# Altium schematic sheet JapaneseLayout_OJP_V0_1_Page_2.SchDoc: OJP Japanese Panel
size B; Author: TVW; DrawnBy: TVW; Revision: Alpha 1; SheetNumber: 2; SheetTotal: 1; PageSetup: Record=PageOptions|CenterHorizontal=True|CenterVertical=True|PrintScale=0.95|XCorrection=1.00|YCorrection=1.00|PrintKind=1|BorderSize=5000000|LeftOffset=0|BottomOffset=0|Orientation=2|PaperLength=1000|PaperWidth=1000|Scale=100|PaperSource=7|PrintQuality=-4|MediaType=1|DitherType=10|PaperKind=Letter|PrintScaleMode=1
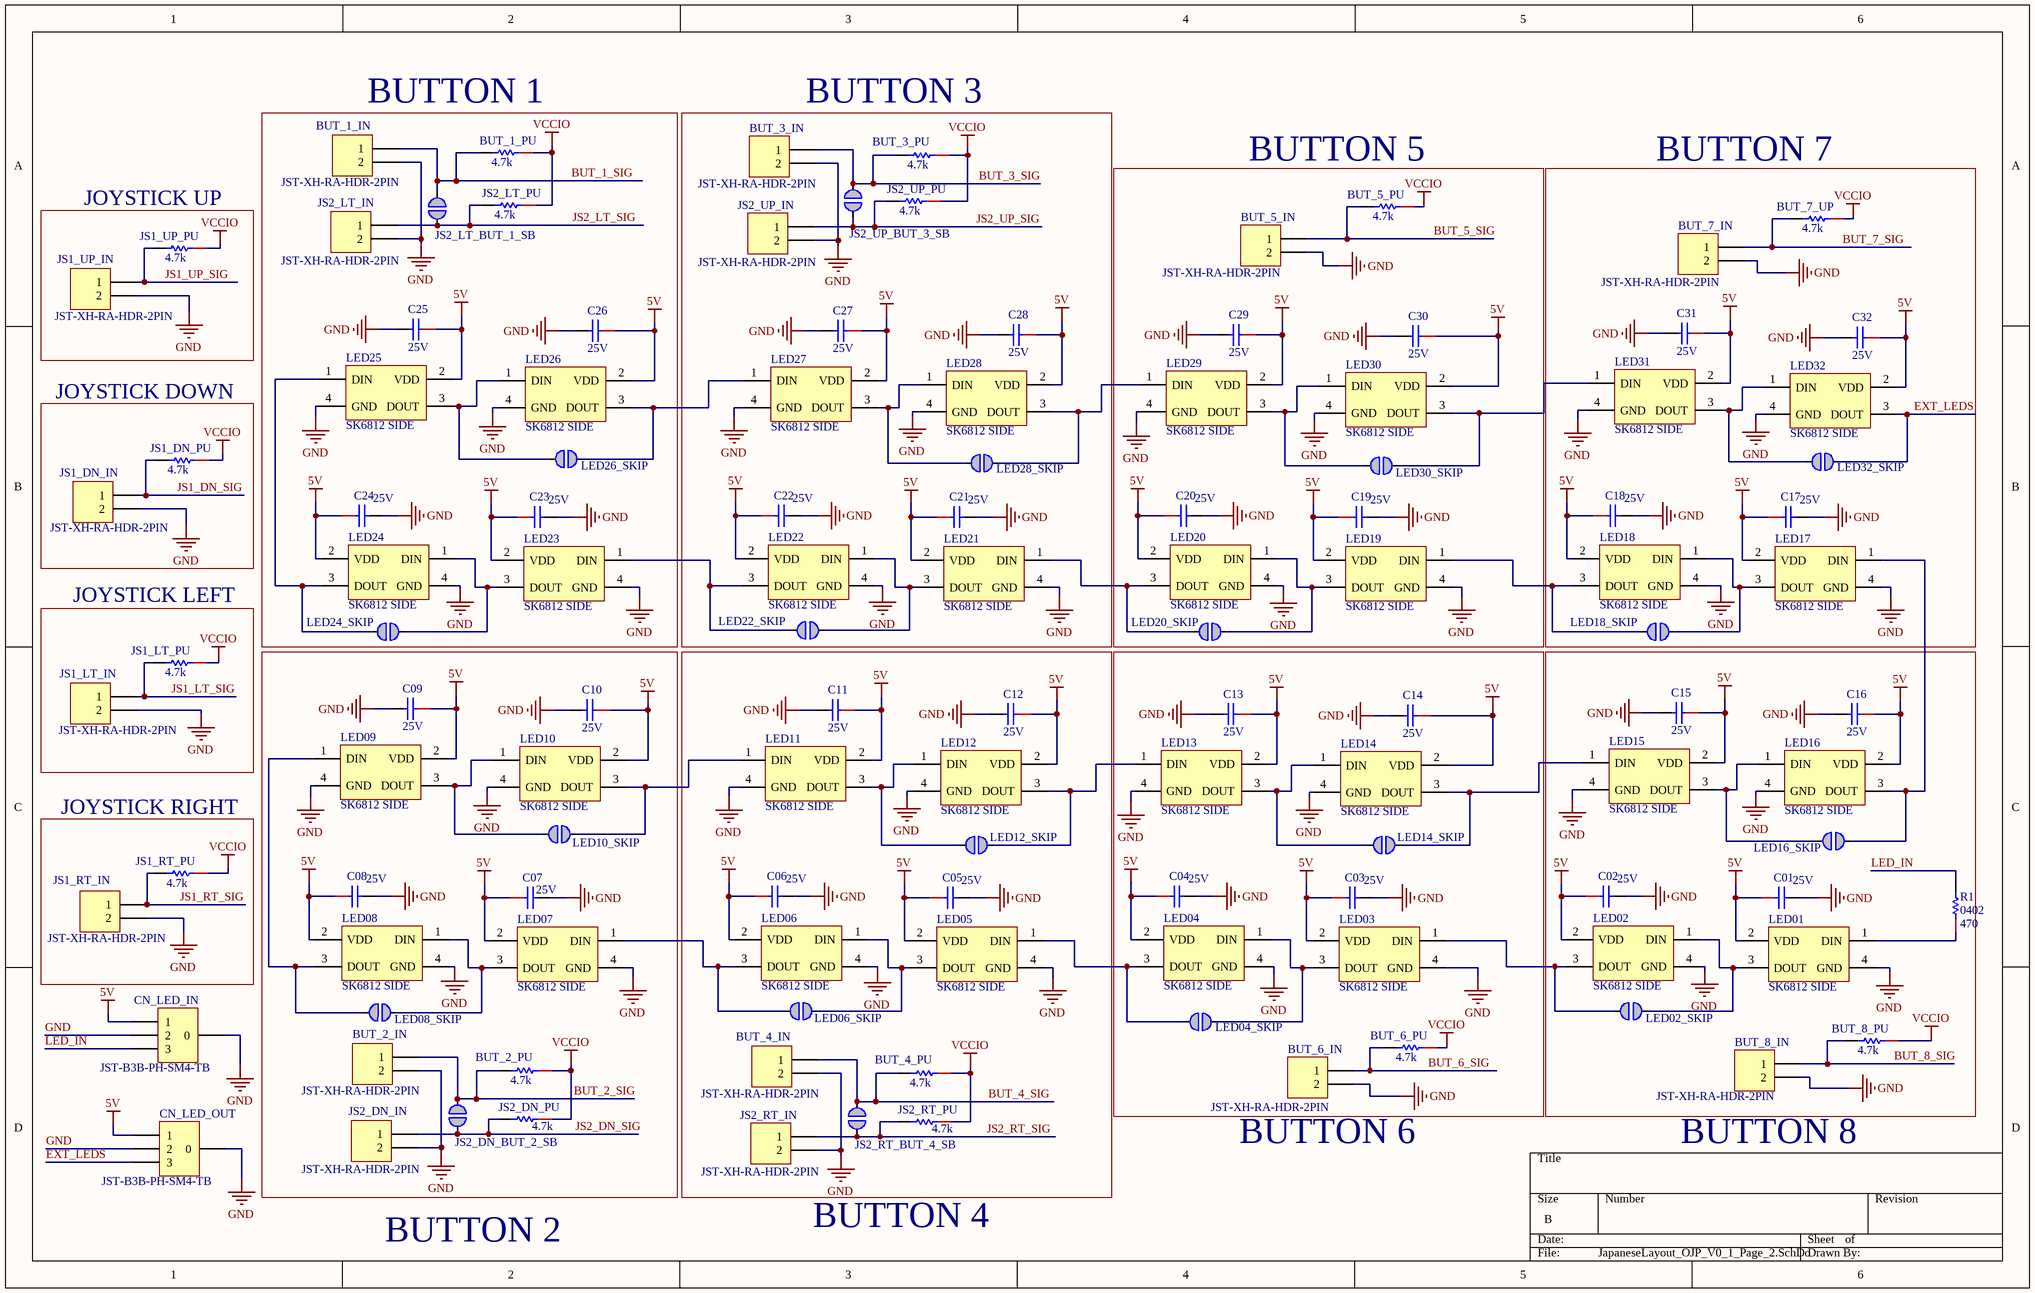
[diagram p0: JapaneseLayout_OJP_V0_1_Page_2.SchDoc]

## Parts
BUT_1_IN  JST-XH-RA-HDR-2PIN  [JST-XH-RA-HDR-2PIN]
BUT_1_PU  4.7K  [RESC0402(1005)_N]  (no BOM)
BUT_2_IN  JST-XH-RA-HDR-2PIN  [JST-XH-RA-HDR-2PIN]
BUT_2_PU  4.7K  [RESC0402(1005)_N]  (no BOM)
BUT_3_IN  JST-XH-RA-HDR-2PIN  [JST-XH-RA-HDR-2PIN]
BUT_3_PU  4.7K  [RESC0402(1005)_N]  (no BOM)
BUT_4_IN  JST-XH-RA-HDR-2PIN  [JST-XH-RA-HDR-2PIN]
BUT_4_PU  4.7K  [RESC0402(1005)_N]  (no BOM)
BUT_5_IN  JST-XH-RA-HDR-2PIN  [JST-XH-RA-HDR-2PIN]
BUT_5_PU  4.7K  [RESC0402(1005)_N]  (no BOM)
BUT_6_IN  JST-XH-RA-HDR-2PIN  [JST-XH-RA-HDR-2PIN]
BUT_6_PU  4.7K  [RESC0402(1005)_N]  (no BOM)
BUT_7_IN  JST-XH-RA-HDR-2PIN  [JST-XH-RA-HDR-2PIN]
BUT_7_UP  4.7K  [RESC0402(1005)_N]  (no BOM)
BUT_8_IN  JST-XH-RA-HDR-2PIN  [JST-XH-RA-HDR-2PIN]
BUT_8_PU  4.7K  [RESC0402(1005)_N]  (no BOM)
C01  Voltage - Rated: 25V  [CAPC0402(1005)_N]  (hidden comment: CAP CER 0.1UF 25V 10% X5R 0402)
C02  Voltage - Rated: 25V  [CAPC0402(1005)_N]  (hidden comment: CAP CER 0.1UF 25V 10% X5R 0402)
C03  Voltage - Rated: 25V  [CAPC0402(1005)_N]  (hidden comment: CAP CER 0.1UF 25V 10% X5R 0402)
C04  Voltage - Rated: 25V  [CAPC0402(1005)_N]  (hidden comment: CAP CER 0.1UF 25V 10% X5R 0402)
C05  Voltage - Rated: 25V  [CAPC0402(1005)_N]  (hidden comment: CAP CER 0.1UF 25V 10% X5R 0402)
C06  Voltage - Rated: 25V  [CAPC0402(1005)_N]  (hidden comment: CAP CER 0.1UF 25V 10% X5R 0402)
C07  Voltage - Rated: 25V  [CAPC0402(1005)_N]  (hidden comment: CAP CER 0.1UF 25V 10% X5R 0402)
C08  Voltage - Rated: 25V  [CAPC0402(1005)_N]  (hidden comment: CAP CER 0.1UF 25V 10% X5R 0402)
C09  Voltage - Rated: 25V  [CAPC0402(1005)_N]  (hidden comment: CAP CER 0.1UF 25V 10% X5R 0402)
C10  Voltage - Rated: 25V  [CAPC0402(1005)_N]  (hidden comment: CAP CER 0.1UF 25V 10% X5R 0402)
C11  Voltage - Rated: 25V  [CAPC0402(1005)_N]  (hidden comment: CAP CER 0.1UF 25V 10% X5R 0402)
C12  Voltage - Rated: 25V  [CAPC0402(1005)_N]  (hidden comment: CAP CER 0.1UF 25V 10% X5R 0402)
C13  Voltage - Rated: 25V  [CAPC0402(1005)_N]  (hidden comment: CAP CER 0.1UF 25V 10% X5R 0402)
C14  Voltage - Rated: 25V  [CAPC0402(1005)_N]  (hidden comment: CAP CER 0.1UF 25V 10% X5R 0402)
C15  Voltage - Rated: 25V  [CAPC0402(1005)_N]  (hidden comment: CAP CER 0.1UF 25V 10% X5R 0402)
C16  Voltage - Rated: 25V  [CAPC0402(1005)_N]  (hidden comment: CAP CER 0.1UF 25V 10% X5R 0402)
C17  Voltage - Rated: 25V  [CAPC0402(1005)_N]  (hidden comment: CAP CER 0.1UF 25V 10% X5R 0402)
C18  Voltage - Rated: 25V  [CAPC0402(1005)_N]  (hidden comment: CAP CER 0.1UF 25V 10% X5R 0402)
C19  Voltage - Rated: 25V  [CAPC0402(1005)_N]  (hidden comment: CAP CER 0.1UF 25V 10% X5R 0402)
C20  Voltage - Rated: 25V  [CAPC0402(1005)_N]  (hidden comment: CAP CER 0.1UF 25V 10% X5R 0402)
C21  Voltage - Rated: 25V  [CAPC0402(1005)_N]  (hidden comment: CAP CER 0.1UF 25V 10% X5R 0402)
C22  Voltage - Rated: 25V  [CAPC0402(1005)_N]  (hidden comment: CAP CER 0.1UF 25V 10% X5R 0402)
C23  Voltage - Rated: 25V  [CAPC0402(1005)_N]  (hidden comment: CAP CER 0.1UF 25V 10% X5R 0402)
C24  Voltage - Rated: 25V  [CAPC0402(1005)_N]  (hidden comment: CAP CER 0.1UF 25V 10% X5R 0402)
C25  Voltage - Rated: 25V  [CAPC0402(1005)_N]  (hidden comment: CAP CER 0.1UF 25V 10% X5R 0402)
C26  Voltage - Rated: 25V  [CAPC0402(1005)_N]  (hidden comment: CAP CER 0.1UF 25V 10% X5R 0402)
C27  Voltage - Rated: 25V  [CAPC0402(1005)_N]  (hidden comment: CAP CER 0.1UF 25V 10% X5R 0402)
C28  Voltage - Rated: 25V  [CAPC0402(1005)_N]  (hidden comment: CAP CER 0.1UF 25V 10% X5R 0402)
C29  Voltage - Rated: 25V  [CAPC0402(1005)_N]  (hidden comment: CAP CER 0.1UF 25V 10% X5R 0402)
C30  Voltage - Rated: 25V  [CAPC0402(1005)_N]  (hidden comment: CAP CER 0.1UF 25V 10% X5R 0402)
C31  Voltage - Rated: 25V  [CAPC0402(1005)_N]  (hidden comment: CAP CER 0.1UF 25V 10% X5R 0402)
C32  Voltage - Rated: 25V  [CAPC0402(1005)_N]  (hidden comment: CAP CER 0.1UF 25V 10% X5R 0402)
CN_LED_IN  JST-B3B-PH-SM4-TB  [JST-B3B-PH-SM4-TB]
CN_LED_OUT  JST-B3B-PH-SM4-TB  [JST-B3B-PH-SM4-TB]
JS1_DN_IN  JST-XH-RA-HDR-2PIN  [JST-XH-RA-HDR-2PIN]
JS1_DN_PU  4.7K  [RESC0402(1005)_N]  (no BOM)
JS1_LT_IN  JST-XH-RA-HDR-2PIN  [JST-XH-RA-HDR-2PIN]
JS1_LT_PU  4.7K  [RESC0402(1005)_N]  (no BOM)
JS1_RT_IN  JST-XH-RA-HDR-2PIN  [JST-XH-RA-HDR-2PIN]
JS1_RT_PU  4.7K  [RESC0402(1005)_N]  (no BOM)
JS1_UP_IN  JST-XH-RA-HDR-2PIN  [JST-XH-RA-HDR-2PIN]
JS1_UP_PU  4.7K  [RESC0402(1005)_N]  (no BOM)
JS2_DN_BUT_2_SB  SOLDERBRIDGE  [Solderbridge]  (value not drawn)  (no BOM)
JS2_DN_IN  JST-XH-RA-HDR-2PIN  [JST-XH-RA-HDR-2PIN]
JS2_DN_PU  4.7K  [RESC0402(1005)_N]  (no BOM)
JS2_LT_BUT_1_SB  SOLDERBRIDGE  [Solderbridge]  (value not drawn)  (no BOM)
JS2_LT_IN  JST-XH-RA-HDR-2PIN  [JST-XH-RA-HDR-2PIN]
JS2_LT_PU  4.7K  [RESC0402(1005)_N]  (no BOM)
JS2_RT_BUT_4_SB  SOLDERBRIDGE  [Solderbridge]  (value not drawn)  (no BOM)
JS2_RT_IN  JST-XH-RA-HDR-2PIN  [JST-XH-RA-HDR-2PIN]
JS2_RT_PU  4.7K  [RESC0402(1005)_N]  (no BOM)
JS2_UP_BUT_3_SB  SOLDERBRIDGE  [Solderbridge]  (value not drawn)  (no BOM)
JS2_UP_IN  JST-XH-RA-HDR-2PIN  [JST-XH-RA-HDR-2PIN]
JS2_UP_PU  4.7K  [RESC0402(1005)_N]  (no BOM)
LED01  SK6812 SIDE  [SOT-553]
LED02  SK6812 SIDE  [SOT-553]
LED02_SKIP  SOLDERBRIDGE  [Solderbridge]  (value not drawn)  (no BOM)
LED03  SK6812 SIDE  [SOT-553]
LED04  SK6812 SIDE  [SOT-553]
LED04_SKIP  SOLDERBRIDGE  [Solderbridge]  (value not drawn)  (no BOM)
LED05  SK6812 SIDE  [SOT-553]
LED06  SK6812 SIDE  [SOT-553]
LED06_SKIP  SOLDERBRIDGE  [Solderbridge]  (value not drawn)  (no BOM)
LED07  SK6812 SIDE  [SOT-553]
LED08  SK6812 SIDE  [SOT-553]
LED08_SKIP  SOLDERBRIDGE  [Solderbridge]  (value not drawn)  (no BOM)
LED09  SK6812 SIDE  [SOT-553]
LED10  SK6812 SIDE  [SOT-553]
LED10_SKIP  SOLDERBRIDGE  [Solderbridge]  (value not drawn)  (no BOM)
LED11  SK6812 SIDE  [SOT-553]
LED12  SK6812 SIDE  [SOT-553]
LED12_SKIP  SOLDERBRIDGE  [Solderbridge]  (value not drawn)  (no BOM)
LED13  SK6812 SIDE  [SOT-553]
LED14  SK6812 SIDE  [SOT-553]
LED14_SKIP  SOLDERBRIDGE  [Solderbridge]  (value not drawn)  (no BOM)
LED15  SK6812 SIDE  [SOT-553]
LED16  SK6812 SIDE  [SOT-553]
LED16_SKIP  SOLDERBRIDGE  [Solderbridge]  (value not drawn)  (no BOM)
LED17  SK6812 SIDE  [SOT-553]
LED18  SK6812 SIDE  [SOT-553]
LED18_SKIP  SOLDERBRIDGE  [Solderbridge]  (value not drawn)  (no BOM)
LED19  SK6812 SIDE  [SOT-553]
LED20  SK6812 SIDE  [SOT-553]
LED20_SKIP  SOLDERBRIDGE  [Solderbridge]  (value not drawn)  (no BOM)
LED21  SK6812 SIDE  [SOT-553]
LED22  SK6812 SIDE  [SOT-553]
LED22_SKIP  SOLDERBRIDGE  [Solderbridge]  (value not drawn)  (no BOM)
LED23  SK6812 SIDE  [SOT-553]
LED24  SK6812 SIDE  [SOT-553]
LED24_SKIP  SOLDERBRIDGE  [Solderbridge]  (value not drawn)  (no BOM)
LED25  SK6812 SIDE  [SOT-553]
LED26  SK6812 SIDE  [SOT-553]
LED26_SKIP  SOLDERBRIDGE  [Solderbridge]  (value not drawn)  (no BOM)
LED27  SK6812 SIDE  [SOT-553]
LED28  SK6812 SIDE  [SOT-553]
LED28_SKIP  SOLDERBRIDGE  [Solderbridge]  (value not drawn)  (no BOM)
LED29  SK6812 SIDE  [SOT-553]
LED30  SK6812 SIDE  [SOT-553]
LED30_SKIP  SOLDERBRIDGE  [Solderbridge]  (value not drawn)  (no BOM)
LED31  SK6812 SIDE  [SOT-553]
LED32  SK6812 SIDE  [SOT-553]
LED32_SKIP  SOLDERBRIDGE  [Solderbridge]  (value not drawn)  (no BOM)
R1  Package (Imperial): 0402  [RESC0402(1005)_M]  (hidden comment: 470)

## Blocks framed on the sheet
BUTTON 1: BUT_1_IN BUT_1_PU C23-C26 JS2_LT_BUT_1_SB JS2_LT_IN JS2_LT_PU LED23 LED24 LED24_SKIP LED25 LED26 LED26_SKIP
BUTTON 3: BUT_3_IN BUT_3_PU C21 C22 C27 C28 JS2_UP_BUT_3_SB JS2_UP_IN JS2_UP_PU LED21 LED22 LED22_SKIP LED27 LED28 LED28_SKIP
BUTTON 5: BUT_5_IN BUT_5_PU C19 C20 C29 C30 LED19 LED20 LED20_SKIP LED29 LED30 LED30_SKIP
BUTTON 7: BUT_7_IN BUT_7_UP C17 C18 C31 C32 LED17 LED18 LED18_SKIP LED31 LED32 LED32_SKIP
JOYSTICK UP: JS1_UP_IN JS1_UP_PU
JOYSTICK DOWN: JS1_DN_IN JS1_DN_PU
JOYSTICK LEFT: JS1_LT_IN JS1_LT_PU
JOYSTICK RIGHT: JS1_RT_IN JS1_RT_PU

## Nets
5V: C01.1 C02.1 C03.1 C04.1 C05.1 C06.1 C07.1 C08.1 C09.1 C10.1 C11.1 C12.1 C13.1 C14.1 C15.1 C16.1 C17.1 C18.1 C19.1 C20.1 C21.1 C22.1 C23.1 C24.1 C25.1 C26.1 C27.1 C28.1 C29.1 C30.1 C31.1 C32.1 CN_LED_IN.1 CN_LED_OUT.1 LED01.2(VDD) LED02.2(VDD) LED03.2(VDD) LED04.2(VDD) LED05.2(VDD) LED06.2(VDD) LED07.2(VDD) LED08.2(VDD) LED09.2(VDD) LED10.2(VDD) LED11.2(VDD) LED12.2(VDD) LED13.2(VDD) LED14.2(VDD) LED15.2(VDD) LED16.2(VDD) LED17.2(VDD) LED18.2(VDD) LED19.2(VDD) LED20.2(VDD) LED21.2(VDD) LED22.2(VDD) LED23.2(VDD) LED24.2(VDD) LED25.2(VDD) LED26.2(VDD) LED27.2(VDD) LED28.2(VDD) LED29.2(VDD) LED30.2(VDD) LED31.2(VDD) LED32.2(VDD)
GND: BUT_1_IN.2 BUT_2_IN.2 BUT_3_IN.2 BUT_4_IN.2 BUT_5_IN.2 BUT_6_IN.2 BUT_7_IN.2 BUT_8_IN.2 C01.2 C02.2 C03.2 C04.2 C05.2 C06.2 C07.2 C08.2 C09.2 C10.2 C11.2 C12.2 C13.2 C14.2 C15.2 C16.2 C17.2 C18.2 C19.2 C20.2 C21.2 C22.2 C23.2 C24.2 C25.2 C26.2 C27.2 C28.2 C29.2 C30.2 C31.2 C32.2 CN_LED_IN.0 CN_LED_IN.2 CN_LED_OUT.0 CN_LED_OUT.2 JS1_DN_IN.2 JS1_LT_IN.2 JS1_RT_IN.2 JS1_UP_IN.2 JS2_DN_IN.2 JS2_LT_IN.2 JS2_RT_IN.2 JS2_UP_IN.2 LED01.4(GND) LED02.4(GND) LED03.4(GND) LED04.4(GND) LED05.4(GND) LED06.4(GND) LED07.4(GND) LED08.4(GND) LED09.4(GND) LED10.4(GND) LED11.4(GND) LED12.4(GND) LED13.4(GND) LED14.4(GND) LED15.4(GND) LED16.4(GND) LED17.4(GND) LED18.4(GND) LED19.4(GND) LED20.4(GND) LED21.4(GND) LED22.4(GND) LED23.4(GND) LED24.4(GND) LED25.4(GND) LED26.4(GND) LED27.4(GND) LED28.4(GND) LED29.4(GND) LED30.4(GND) LED31.4(GND) LED32.4(GND)
VCCIO: BUT_1_PU.1 BUT_2_PU.1 BUT_3_PU.1 BUT_4_PU.1 BUT_5_PU.1 BUT_6_PU.1 BUT_7_UP.1 BUT_8_PU.1 JS1_DN_PU.1 JS1_LT_PU.1 JS1_RT_PU.1 JS1_UP_PU.1 JS2_DN_PU.1 JS2_LT_PU.1 JS2_RT_PU.1 JS2_UP_PU.1
BUT_1_SIG: BUT_1_IN.1 BUT_1_PU.2 JS2_LT_BUT_1_SB.1
BUT_2_SIG: BUT_2_IN.1 BUT_2_PU.2 JS2_DN_BUT_2_SB.1
BUT_3_SIG: BUT_3_IN.1 BUT_3_PU.2 JS2_UP_BUT_3_SB.1
BUT_4_SIG: BUT_4_IN.1 BUT_4_PU.2 JS2_RT_BUT_4_SB.1
BUT_5_SIG: BUT_5_IN.1 BUT_5_PU.2
BUT_6_SIG: BUT_6_IN.1 BUT_6_PU.2
BUT_7_SIG: BUT_7_IN.1 BUT_7_UP.2
BUT_8_SIG: BUT_8_IN.1 BUT_8_PU.2
EXT_LEDS: CN_LED_OUT.3 LED32.3(DOUT) LED32_SKIP.1
JS1_DN_SIG: JS1_DN_IN.1 JS1_DN_PU.2
JS1_LT_SIG: JS1_LT_IN.1 JS1_LT_PU.2
JS1_RT_SIG: JS1_RT_IN.1 JS1_RT_PU.2
JS1_UP_SIG: JS1_UP_IN.1 JS1_UP_PU.2
JS2_DN_SIG: JS2_DN_BUT_2_SB.2 JS2_DN_IN.1 JS2_DN_PU.2
JS2_LT_SIG: JS2_LT_BUT_1_SB.2 JS2_LT_IN.1 JS2_LT_PU.2
JS2_RT_SIG: JS2_RT_BUT_4_SB.2 JS2_RT_IN.1 JS2_RT_PU.2
JS2_UP_SIG: JS2_UP_BUT_3_SB.2 JS2_UP_IN.1 JS2_UP_PU.2
LED_IN: CN_LED_IN.3 R1.2
NetLED01_1: LED01.1(DIN) R1.1
NetLED01_3: LED01.3(DOUT) LED02.1(DIN) LED02_SKIP.1
NetLED02_3: LED02.3(DOUT) LED02_SKIP.2 LED03.1(DIN)
NetLED03_3: LED03.3(DOUT) LED04.1(DIN) LED04_SKIP.1
NetLED04_3: LED04.3(DOUT) LED04_SKIP.2 LED05.1(DIN)
NetLED05_3: LED05.3(DOUT) LED06.1(DIN) LED06_SKIP.1
NetLED06_3: LED06.3(DOUT) LED06_SKIP.2 LED07.1(DIN)
NetLED07_3: LED07.3(DOUT) LED08.1(DIN) LED08_SKIP.1
NetLED08_3: LED08.3(DOUT) LED08_SKIP.2 LED09.1(DIN)
NetLED09_3: LED09.3(DOUT) LED10.1(DIN) LED10_SKIP.2
NetLED10_3: LED10.3(DOUT) LED10_SKIP.1 LED11.1(DIN)
NetLED11_3: LED11.3(DOUT) LED12.1(DIN) LED12_SKIP.2
NetLED12_3: LED12.3(DOUT) LED12_SKIP.1 LED13.1(DIN)
NetLED13_3: LED13.3(DOUT) LED14.1(DIN) LED14_SKIP.2
NetLED14_3: LED14.3(DOUT) LED14_SKIP.1 LED15.1(DIN)
NetLED15_3: LED15.3(DOUT) LED16.1(DIN) LED16_SKIP.2
NetLED16_3: LED16.3(DOUT) LED16_SKIP.1 LED17.1(DIN)
NetLED17_3: LED17.3(DOUT) LED18.1(DIN) LED18_SKIP.1
NetLED18_3: LED18.3(DOUT) LED18_SKIP.2 LED19.1(DIN)
NetLED19_3: LED19.3(DOUT) LED20.1(DIN) LED20_SKIP.1
NetLED20_3: LED20.3(DOUT) LED20_SKIP.2 LED21.1(DIN)
NetLED21_3: LED21.3(DOUT) LED22.1(DIN) LED22_SKIP.1
NetLED22_3: LED22.3(DOUT) LED22_SKIP.2 LED23.1(DIN)
NetLED23_3: LED23.3(DOUT) LED24.1(DIN) LED24_SKIP.1
NetLED24_3: LED24.3(DOUT) LED24_SKIP.2 LED25.1(DIN)
NetLED25_3: LED25.3(DOUT) LED26.1(DIN) LED26_SKIP.2
NetLED26_3: LED26.3(DOUT) LED26_SKIP.1 LED27.1(DIN)
NetLED27_3: LED27.3(DOUT) LED28.1(DIN) LED28_SKIP.2
NetLED28_3: LED28.3(DOUT) LED28_SKIP.1 LED29.1(DIN)
NetLED29_3: LED29.3(DOUT) LED30.1(DIN) LED30_SKIP.2
NetLED30_3: LED30.3(DOUT) LED30_SKIP.1 LED31.1(DIN)
NetLED31_3: LED31.3(DOUT) LED32.1(DIN) LED32_SKIP.2

## Notes on the sheet
- (near BUT_6_IN) BUTTON 6
- (near BUT_8_IN) BUTTON 8
- BUTTON 2
- BUTTON 4
- Title
- By:
- Date:
- Number:
- Time:
- Revision:
- Sheet
- of
- OLogic, Inc.
- 3350 Scott Blvd. Bldg 47
- Santa Clara, CA
- 95054 USA
- File:
- (650) 996-1490

## Library data of the parts
BUT_1_IN BUT_2_IN BUT_3_IN BUT_4_IN BUT_5_IN BUT_6_IN BUT_7_IN BUT_8_IN JS1_DN_IN JS1_LT_IN JS1_RT_IN JS1_UP_IN JS2_DN_IN JS2_LT_IN JS2_RT_IN JS2_UP_IN = CMP-001-1623-04: 2.5 mm JST XH-Style Shrouded Male Connector: 2-Pin, Right Angle; Pololu #2718
BUT_1_PU BUT_2_PU BUT_3_PU BUT_4_PU BUT_5_PU BUT_6_PU BUT_7_UP BUT_8_PU JS1_DN_PU JS1_LT_PU JS1_RT_PU JS1_UP_PU JS2_DN_PU JS2_LT_PU JS2_RT_PU JS2_UP_PU = CMP-007-0497-12: RES 4.7K OHM 1% 1/10W 0402; Power: 100mW; Temperature Coefficient: 100ppm/°C; Package_Imperial: 0402; Package_Metric: 1005; Termination: SMD/SMT; Resistance: 4.7k; Tolerance: 1%; Width: 500µm; Length: 1mm; Height: 550µm
C01 C02 C03 C04 C05 C06 C07 C08 C09-C32 = CMP-007-0044-02: 0.1uF 0402 25V; Manufacturer: Taiyo Yuden; Manufacturer Part Number: TMK105BJ104KV-F; Notification: Current market demand for these product types have resulted in fluctuating and extending lead times. Lead times may differ.; Part Status: Active; ComponentLink1Description: http://ds.yuden.co.jp/TYCOMPAS/ut/detail.do?productNo=TMK105BJ104KV-F&fileName=TMK105BJ104KV-F_SS&mode=specSheetDownload; Ratings: -; Pin Count: 2; Designator: CAP CER 0.1UF 25V 10% X5R 0402; Operating Temperature: -55°C ~ 85°C; Height - Seated (Max): -; Packaging: Cut Tape (CT); Lead Style: -; Temperature Coefficient: X5R; Stock 1: 5172635; Lead Spacing: -; Pricing 1: 1=0.1, 10=0.043, 100=0.019, 500=0.0136, 1000=0.01069, 2500=0.00972, 5000=0.00894 (USD); Mounting Type: Surface Mount, MLCC; RoHS: RoHS Compliant; Tolerance: ±10%; Component Name: CAP CER 0.1UF 25V 10% X5R 0402; Features: -; Applications: General Purpose; ComponentLink1URL: http://ds.yuden.co.jp/TYCOMPAS/ut/detail.do?productNo=TMK105BJ104KV-F&fileName=TMK105BJ104KV-F_SS&mode=specSheetDownload
CN_LED_IN CN_LED_OUT = CMP-001-0357-02: 2mm Locking Header, 3-Pin; Manufacturer Part Number: B3B-PH-SM4-TB(LF)(SN)(P); Manufacturer: JST Sales America Inc; Number of Positions Loaded: All; Number of Positions: 3; Connector Type: Header, Shrouded; Termination: Solder; Stock 1: 32550; Component Name: JST-B3B-PH-SM4-TB; Series: JST-PH; Features: Solder Retention; Contact Finish: Tin; Fastening Type: Detent Lock; Designator: JST-B3B-PH-SM4-TB; Mounting Type: Surface Mount; ComponentLink1Description: http://www.jst-mfg.com/product/pdf/eng/ePH.pdf; Contact Finish Thickness: -; ComponentLink1URL: http://www.jst-mfg.com/product/pdf/eng/ePH.pdf; RoHS: RoHS Compliant; Packaging: Cut Tape (CT); Contact Type: Male Pin; Color: Natural; Pricing 1: 1=0.6, 10=0.566, 25=0.5096, 50=0.4528, 100=0.434, 250=0.39628, 500=0.37742 (USD); Number of Rows: 1; Row Spacing: -; Pin Count: 4
JS2_DN_BUT_2_SB JS2_LT_BUT_1_SB JS2_RT_BUT_4_SB JS2_UP_BUT_3_SB LED02_SKIP LED04_SKIP LED06_SKIP LED08_SKIP LED10_SKIP LED12_SKIP LED14_SKIP LED16_SKIP LED18_SKIP LED20_SKIP LED22_SKIP LED24_SKIP LED26_SKIP LED28_SKIP LED30_SKIP LED32_SKIP = CMP-001-0538-01: Artikkelnr Simpro: N.A.; Component Name: SOLDERBRIDGE; Footprint Doc: Solderbridge; Manufacturer Part Number: *; 2nd source Supplier: *; Value: Solderbridge; Published: 2009-12-14; Publisher: Nordic Semiconductor; Manufacturer: *; Datasheet: *; Designator: SOLDERBRIDGE; Note: *; 2nd source part number: *; LatestRevisionDate: 2009-12-14; Part Number: Solderbridge; Artikkelnr Noca: N.A.; Pin Count: 2
LED01 LED02 LED03 LED04 LED05 LED06 LED07 LED08 LED09-LED32 = CMP-00277-02: SK6812 SIDE 4020 RGB LED
R1 = CMP-007-0512-11: RES 470 OHM 1% 1/10W 0402; Temperature Coefficient: ±100ppm/°C; Power: 63mW; Package (Metric): 1005; Operating Temperature: -55°C ~ 155°C; Height: 400µm; Length: 1mm; Termination: SMD/SMT; Tolerance: 1%; Resistance: 470